# Altium schematic sheet GPS_Tracking_V1.0.SchDoc
size A4
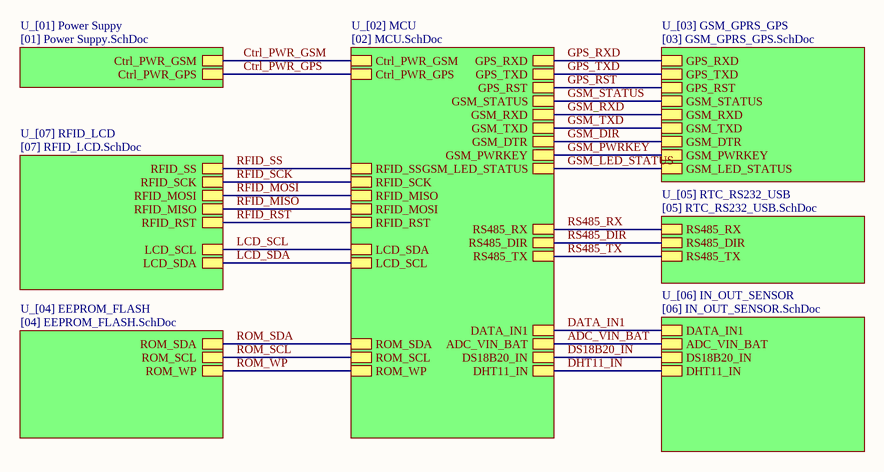
[diagram p0: GPS_Tracking_V1.0.SchDoc]

## Sub-sheets
U_[01] Power Suppy = [01] Power Suppy.SchDoc: Ctrl_PWR_GSM, Ctrl_PWR_GPS
U_[02] MCU = [02] MCU.SchDoc: GSM_STATUS, GSM_DTR, GSM_PWRKEY, DATA_IN1, GPS_RXD, GPS_TXD, GPS_RST, Ctrl_PWR_GPS, GSM_RXD, GSM_TXD, Ctrl_PWR_GSM, RS485_TX, RS485_RX, RS485_DIR, ADC_VIN_BAT, DHT11_IN, DS18B20_IN, GSM_LED_STATUS, RFID_SS, RFID_SCK, RFID_MISO, RFID_MOSI, RFID_RST, LCD_SDA, LCD_SCL, ROM_SDA, ROM_SCL, ROM_WP
U_[03] GSM_GPRS_GPS = [03] GSM_GPRS_GPS.SchDoc: GPS_RXD, GPS_TXD, GPS_RST, GSM_STATUS, GSM_RXD, GSM_TXD, GSM_DTR, GSM_PWRKEY, GSM_LED_STATUS
U_[04] EEPROM_FLASH = [04] EEPROM_FLASH.SchDoc: ROM_SDA, ROM_SCL, ROM_WP
U_[05] RTC_RS232_USB = [05] RTC_RS232_USB.SchDoc: RS485_RX, RS485_DIR, RS485_TX
U_[06] IN_OUT_SENSOR = [06] IN_OUT_SENSOR.SchDoc: DATA_IN1, ADC_VIN_BAT, DS18B20_IN, DHT11_IN
U_[07] RFID_LCD = [07] RFID_LCD.SchDoc: RFID_SS, RFID_SCK, RFID_MOSI, RFID_MISO, RFID_RST, LCD_SCL, LCD_SDA

## Nets
ADC_VIN_BAT: sheet U_[02] MCU/ADC_VIN_BAT, sheet U_[06] IN_OUT_SENSOR/ADC_VIN_BAT
Ctrl_PWR_GPS: sheet U_[01] Power Suppy/Ctrl_PWR_GPS, sheet U_[02] MCU/Ctrl_PWR_GPS
Ctrl_PWR_GSM: sheet U_[01] Power Suppy/Ctrl_PWR_GSM, sheet U_[02] MCU/Ctrl_PWR_GSM
DATA_IN1: sheet U_[02] MCU/DATA_IN1, sheet U_[06] IN_OUT_SENSOR/DATA_IN1
DHT11_IN: sheet U_[02] MCU/DHT11_IN, sheet U_[06] IN_OUT_SENSOR/DHT11_IN
DS18B20_IN: sheet U_[02] MCU/DS18B20_IN, sheet U_[06] IN_OUT_SENSOR/DS18B20_IN
GPS_RST: sheet U_[03] GSM_GPRS_GPS/GPS_RST, sheet U_[02] MCU/GPS_RST
GPS_RXD: sheet U_[03] GSM_GPRS_GPS/GPS_RXD, sheet U_[02] MCU/GPS_RXD
GPS_TXD: sheet U_[03] GSM_GPRS_GPS/GPS_TXD, sheet U_[02] MCU/GPS_TXD
GSM_DIR: sheet U_[03] GSM_GPRS_GPS/GSM_DTR, sheet U_[02] MCU/GSM_DTR
GSM_LED_STATUS: sheet U_[03] GSM_GPRS_GPS/GSM_LED_STATUS, sheet U_[02] MCU/GSM_LED_STATUS
GSM_PWRKEY: sheet U_[03] GSM_GPRS_GPS/GSM_PWRKEY, sheet U_[02] MCU/GSM_PWRKEY
GSM_RXD: sheet U_[03] GSM_GPRS_GPS/GSM_RXD, sheet U_[02] MCU/GSM_RXD
GSM_STATUS: sheet U_[03] GSM_GPRS_GPS/GSM_STATUS, sheet U_[02] MCU/GSM_STATUS
GSM_TXD: sheet U_[03] GSM_GPRS_GPS/GSM_TXD, sheet U_[02] MCU/GSM_TXD
LCD_SCL: sheet U_[07] RFID_LCD/LCD_SCL, sheet U_[02] MCU/LCD_SDA
LCD_SDA: sheet U_[07] RFID_LCD/LCD_SDA, sheet U_[02] MCU/LCD_SCL
RFID_MISO: sheet U_[07] RFID_LCD/RFID_MISO, sheet U_[02] MCU/RFID_MOSI
RFID_MOSI: sheet U_[07] RFID_LCD/RFID_MOSI, sheet U_[02] MCU/RFID_MISO
RFID_RST: sheet U_[07] RFID_LCD/RFID_RST, sheet U_[02] MCU/RFID_RST
RFID_SCK: sheet U_[07] RFID_LCD/RFID_SCK, sheet U_[02] MCU/RFID_SCK
RFID_SS: sheet U_[07] RFID_LCD/RFID_SS, sheet U_[02] MCU/RFID_SS
ROM_SCL: sheet U_[04] EEPROM_FLASH/ROM_SCL, sheet U_[02] MCU/ROM_SCL
ROM_SDA: sheet U_[04] EEPROM_FLASH/ROM_SDA, sheet U_[02] MCU/ROM_SDA
ROM_WP: sheet U_[04] EEPROM_FLASH/ROM_WP, sheet U_[02] MCU/ROM_WP
RS485_DIR: sheet U_[05] RTC_RS232_USB/RS485_DIR, sheet U_[02] MCU/RS485_DIR
RS485_RX: sheet U_[05] RTC_RS232_USB/RS485_RX, sheet U_[02] MCU/RS485_RX
RS485_TX: sheet U_[05] RTC_RS232_USB/RS485_TX, sheet U_[02] MCU/RS485_TX